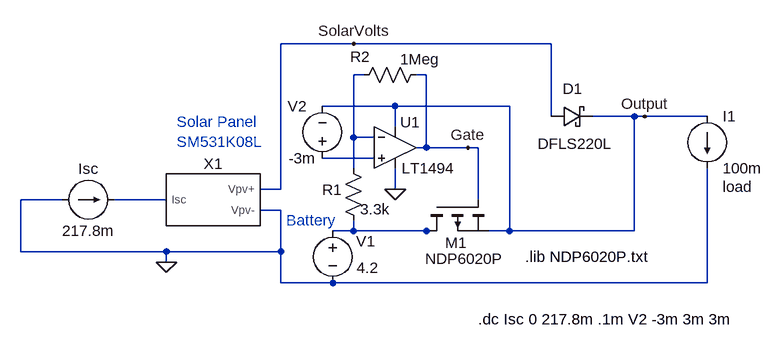
[diagram p0: schematic OffsetAdjust.asc]
OffsetAdjust.asc, the LTspice schematic file:
Version 4
SHEET 1 1416 680
WIRE 320 -64 208 -64
WIRE 624 -64 320 -64
WIRE 336 -16 320 -16
WIRE 432 -16 416 -16
WIRE 384 32 272 32
WIRE 560 32 384 32
WIRE 624 48 624 -64
WIRE 752 48 688 48
WIRE 768 48 752 48
WIRE 864 48 768 48
WIRE 384 64 384 32
WIRE 320 80 320 -16
WIRE 352 80 320 80
WIRE 432 96 432 -16
WIRE 432 96 416 96
WIRE 496 96 432 96
WIRE 512 96 496 96
WIRE 352 112 272 112
WIRE 320 128 320 80
WIRE 208 160 208 -64
WIRE 208 160 176 160
WIRE 384 160 384 128
WIRE -128 176 -192 176
WIRE 32 176 -48 176
WIRE 512 176 512 96
WIRE 208 192 176 192
WIRE 320 224 320 208
WIRE 320 224 288 224
WIRE 432 224 320 224
WIRE 448 224 432 224
WIRE 560 224 560 32
WIRE 560 224 528 224
WIRE 752 224 752 48
WIRE 752 224 560 224
WIRE -192 256 -192 176
WIRE 32 256 -192 256
WIRE 208 256 208 192
WIRE 208 256 32 256
WIRE 32 272 32 256
WIRE 208 304 208 256
WIRE 288 304 208 304
WIRE 864 304 864 128
WIRE 864 304 288 304
FLAG 32 272 0
FLAG 768 48 Output
FLAG 320 -64 SolarVolts
FLAG 496 96 Gate
FLAG 384 160 0
SYMBOL current -128 176 R270
WINDOW 0 32 40 VTop 2
WINDOW 3 -32 40 VBottom 2
WINDOW 123 0 0 Left 0
WINDOW 39 0 0 Left 0
SYMATTR InstName Isc
SYMATTR Value 217.8m
SYMBOL SolarPanel 96 176 R0
SYMATTR InstName X1
SYMBOL voltage 288 208 R0
WINDOW 0 36 32 Left 2
WINDOW 3 37 73 Left 2
SYMATTR InstName V1
SYMATTR Value 4.2
SYMATTR SpiceLine Rser=.0
SYMBOL schottky 624 64 R270
WINDOW 0 43 33 VTop 2
WINDOW 3 -10 37 VBottom 2
SYMATTR InstName D1
SYMATTR Value DFLS220L
SYMATTR Description Diode
SYMATTR Type diode
SYMBOL current 864 48 R0
WINDOW 123 0 0 Left 0
WINDOW 39 24 108 Left 2
SYMATTR SpiceLine load
SYMATTR InstName I1
SYMATTR Value 100m
SYMBOL pmos 432 176 M90
WINDOW 0 66 63 VLeft 2
WINDOW 3 91 118 VLeft 2
SYMATTR InstName M1
SYMATTR Value NDP6020P
SYMATTR Prefix X
SYMBOL OpAmps\\LT1494 384 96 R0
WINDOW 0 8 -39 Left 2
WINDOW 3 10 32 Left 2
SYMATTR InstName U1
SYMBOL voltage 272 128 R180
WINDOW 0 24 96 Left 2
WINDOW 3 10 16 Left 2
SYMATTR InstName V2
SYMATTR Value -3m
SYMBOL res 432 -32 R90
WINDOW 0 4 102 VBottom 2
WINDOW 3 -24 10 VTop 2
SYMATTR InstName R2
SYMATTR Value 1Meg
SYMBOL res 304 112 R0
WINDOW 0 -32 49 Left 2
WINDOW 3 26 79 Left 2
SYMATTR InstName R1
SYMATTR Value 3.3k
TEXT 584 264 Left 2 !.lib NDP6020P.txt
TEXT 512 360 Left 2 !.dc Isc 0 217.8m .1m V2 -3m 3m 3m
TEXT 48 56 Left 2 ;Solar Panel\nSM531K08L
TEXT 216 208 Left 2 ;Battery

The netlist it stands for:
* OffsetAdjust.asc
Isc 0 N003 217.8m
XX1 N003 SolarVolts 0 SolarPanel  ; pins Isc Vpv+ Vpv-
V1 N004 0 4.2 Rser=.0
D1 SolarVolts Output DFLS220L
I1 Output 0 100m load
XM1 N004 Gate Output NDP6020P  ; pins D G S
* U1: LT1494 (symbol OpAmps\LT1494 not available, pins judged from their places): In+=N002 In-=N001 V+=Output V-=0 OUT=Gate
V2 N002 Output -3m
R2 Gate N001 1Meg
R1 N001 N004 3.3k
.model D D
.lib standard.dio
.lib NDP6020P.txt
.dc Isc 0 217.8m .1m V2 -3m 3m 3m
* Solar Panel
* SM531K08L
* Battery
.backanno
.end